# EAGLE schematic shield (EAGLE 7.5.0)
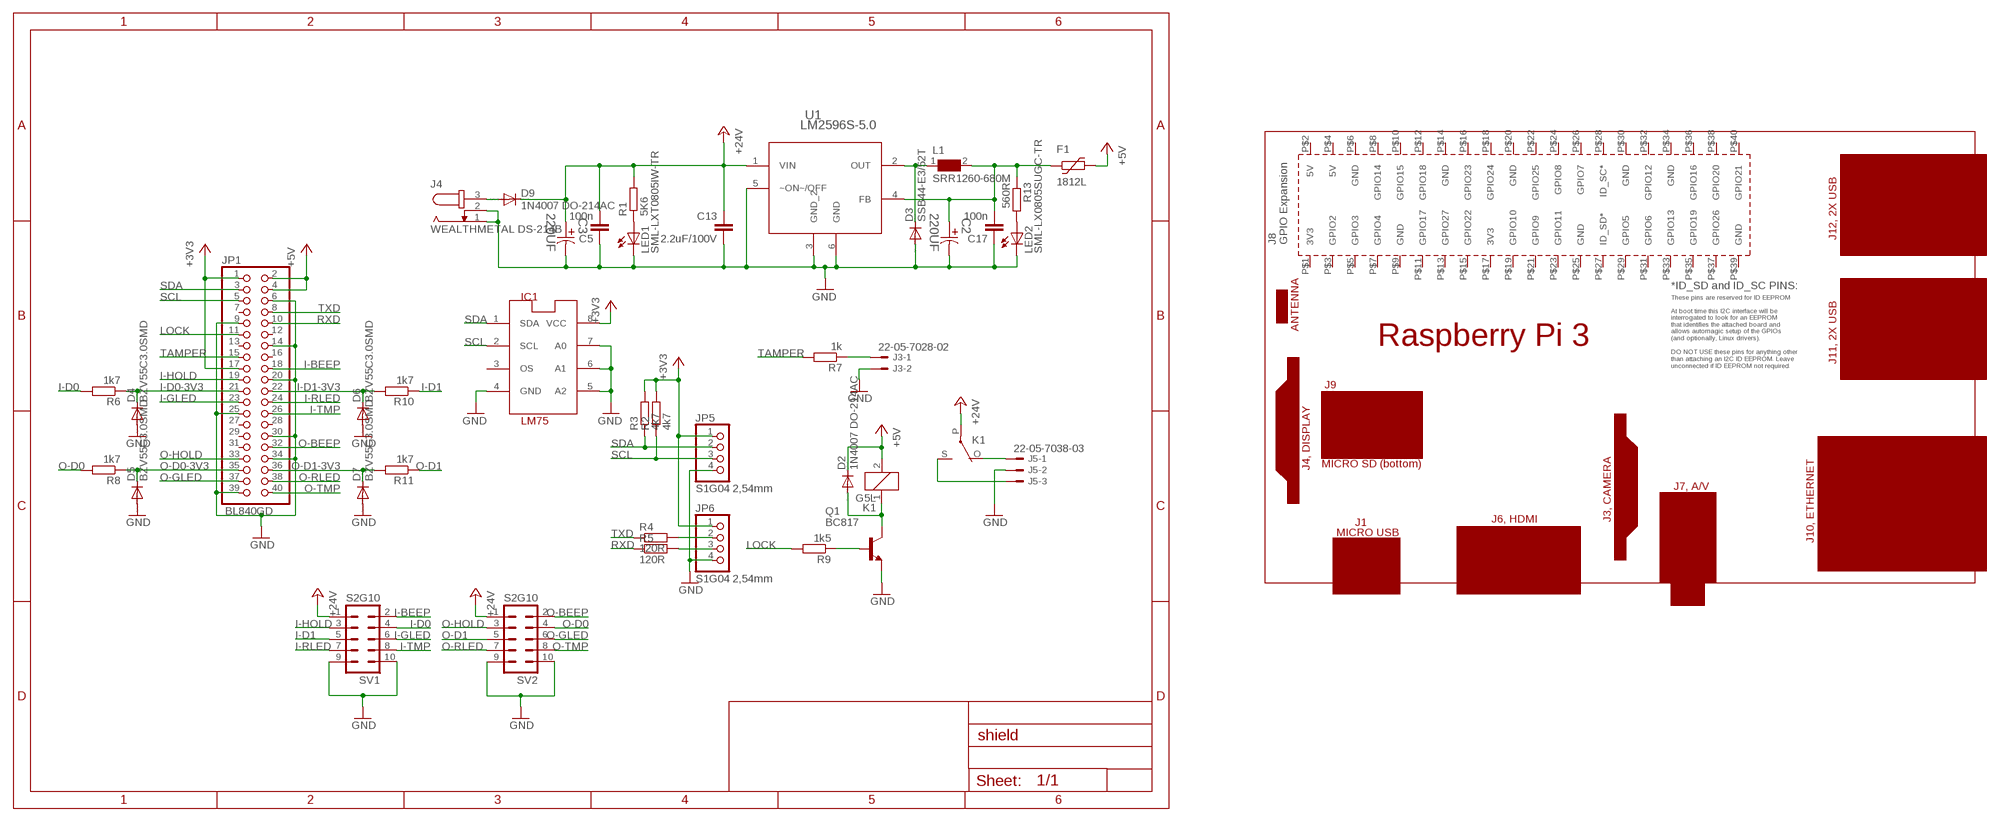
[diagram p0: schematic, sheet 1]

## Parts
C2  220UF  EEE-FP1V221AP-CASE-F  [CAPAE830X1050N]
C3  220UF  EEE-FP1V221AP-CASE-F  [CAPAE830X1050N]
C5  100n  C-EUC0805  [C0805]
C13  2.2uF/100V  C-EUC1206  [C1206]
C17  100n  C-EUC0805  [C0805]
D2  1N4007 DO-214AC  DIODE-DO-214AC  [DO-214AC]
D3  SSB44-E3/52T  DIODE-DO214AA  [DO214AA]
D4  BZV55C3.0SMD  DIODE-MINIMELF  [MINIMELF]
D5  BZV55C3.0SMD  DIODE-MINIMELF  [MINIMELF]
D6  BZV55C3.0SMD  DIODE-MINIMELF  [MINIMELF]
D7  BZV55C3.0SMD  DIODE-MINIMELF  [MINIMELF]
D9  1N4007 DO-214AC  DIODE-DO-214AC  [DO-214AC]
F1  1812L  [1812L]
IC1  LM75  LM75_ICN  [SO8_LM75]
J3  22-05-7028-02  [7395-02]
J4  WEALTHMETAL DS-214B  JACK-PLUG0  [SPC4077]
J5  22-05-7038-03  [7395-03]
JP1  BL840GD  PINHD-2X20  [2X20]
JP5  S1G04 2,54mm  PINHD-1X4  [1X04]
JP6  S1G04 2,54mm  PINHD-1X4  [1X04]
K1  G5L  [G5LE]
L1  SRR1260-680M  WE-PD-7447709680_1260/1245/1280/1210  [WE-PD_1260/1245/1280/1210]
LED1  SML-LXT0805IW-TR  LEDCHIPLED_0805  [CHIPLED_0805]
LED2  SML-LX0805SUGC-TR  LEDCHIPLED_0805  [CHIPLED_0805]
PCB1  RPI3  [RPI3]
Q1  BC817  BC817-16-NPN-SOT23-BEC  [SOT23-BEC]
R1  5K6  R-EU_R0805  [R0805]
R2  4k7  R-EU_R0805  [R0805]
R3  4k7  R-EU_R0805  [R0805]
R4  120R  R-EU_R0805  [R0805]
R5  120R  R-EU_R0805  [R0805]
R6  1k7  R-EU_R0805  [R0805]
R7  1k  R-EU_R0805  [R0805]
R8  1k7  R-EU_R0805  [R0805]
R9  1k5  R-EU_R0805  [R0805]
R10  1k7  R-EU_R0805  [R0805]
R11  1k7  R-EU_R0805  [R0805]
R13  560R  R-EU_R0805  [R0805]
SV1  S2G10  MA05-2  [MA05-2]
SV2  S2G10  MA05-2  [MA05-2]
U1  LM2596S-5.0  [TO170P1435X465-6N]

## Nets
+3V3: IC1.8(VCC) JP1.1 JP1.17 JP5.1 JP6.1 R2.2 R3.2
+5V: D2.C F1.P$2 JP1.2 JP1.4 K1.2
+24V: C3.1 C5.2 C13.1 D9.C K1.P(2:P) R1.2 SV1.1 SV2.1 U1.1(VIN)
GND: C2.2 C3.2 C5.1 C13.2 C17.1 D3.A D4.A D5.A D6.A D7.A IC1.4(GND) IC1.5(A2) IC1.6(A1) IC1.7(A0) J3.2 J4.1 J4.2 J5.2 JP1.6 JP1.9 JP1.14 JP1.20 JP1.25 JP1.30 JP1.34 JP1.39 JP5.4 JP6.4 LED1.C LED2.C Q1.E SV1.9 SV1.10 SV2.9 SV2.10 U1.3(GND_2) U1.5(~ON~/OFF) U1.6(GND)
I-BEEP: JP1.18 SV1.2
I-D0: R6.2 SV1.4
I-D0-3V3: D4.C JP1.21 R6.1
I-D1: R10.1 SV1.5
I-D1-3V3: D6.C JP1.22 R10.2
I-GLED: JP1.23 SV1.6
I-HOLD: JP1.19 SV1.3
I-RLED: JP1.24 SV1.7
I-TMP: JP1.26 SV1.8
LOCK: JP1.11 R9.2
N$1: C2.1 C17.2 F1.P$1 L1.2 R13.1 U1.4(FB)
N$2: J3.1 R7.1
N$3: JP6.2 R4.2
N$4: LED2.A R13.2
N$5: J5.3 K1.S(2:S)
N$6: JP6.3 R5.2
N$7: J5.1 K1.O(2:O)
N$8: D2.A K1.1 Q1.C
N$9: D9.A J4.3
N$10: Q1.B R9.1
N$23: LED1.A R1.1
N$31: D3.C L1.1 U1.2(OUT)
O-BEEP: JP1.32 SV2.2
O-D0: R8.2 SV2.4
O-D0-3V3: D5.C JP1.35 R8.1
O-D1: R11.1 SV2.5
O-D1-3V3: D7.C JP1.36 R11.2
O-GLED: JP1.37 SV2.6
O-HOLD: JP1.33 SV2.3
O-RLED: JP1.38 SV2.7
O-TMP: JP1.40 SV2.8
RXD: JP1.10 R5.1
SCL: IC1.2(SCL) JP1.5 JP5.3 R2.1
SDA: IC1.1(SDA) JP1.3 JP5.2 R3.1
TAMPER: JP1.15 R7.2
TXD: JP1.8 R4.1
Unconnected: IC1.3(OS) JP1.7 JP1.12 JP1.13 JP1.16 JP1.27 JP1.28 JP1.29 JP1.31 PCB1.P$1(3V3) PCB1.P$2(5V) PCB1.P$3(GPIO2) PCB1.P$4(5V) PCB1.P$5(GPIO3) PCB1.P$6(GND) PCB1.P$7(GPIO4) PCB1.P$8(GPIO14) PCB1.P$9(GND) PCB1.P$10(GPIO15) PCB1.P$11(GPIO17) PCB1.P$12(GPIO18) PCB1.P$13(GPIO27) PCB1.P$14(GND) PCB1.P$15(GPIO22) PCB1.P$16(GPIO23) PCB1.P$17(3V3) PCB1.P$18(GPIO24) PCB1.P$19(GPIO10) PCB1.P$20(GND) PCB1.P$21(GPIO9) PCB1.P$22(GPIO25) PCB1.P$23(GPIO11) PCB1.P$24(GPIO8) PCB1.P$25(GND) PCB1.P$26(GPIO7) PCB1.P$27(ID_SD*) PCB1.P$28(ID_SC*) PCB1.P$29(GPIO5) PCB1.P$30(GND) PCB1.P$31(GPIO6) PCB1.P$32(GPIO12) PCB1.P$33(GPIO13) PCB1.P$34(GND) PCB1.P$35(GPIO19) PCB1.P$36(GPIO16) PCB1.P$37(GPIO26) PCB1.P$38(GPIO20) PCB1.P$39(GND) PCB1.P$40(GPIO21)

## Library data of the parts
C2 C3 = Panasonic-EEEFK_EEEFP:EEE-: Aluminum Electrolytic Capacitors,Surface Mount Type; MPN: EEE-FP1V221AP; OC_FARNELL: 1539514; OC_NEWARK: 94M7043; PACKAGE: CASE-F; SUPPLIER: PANASONIC; TOLERANCE: ±20 %; VOLTAGERATING: 35V
C5 C13 C17 = rcl:C-EU: CAPACITOR, European symbol
D2-D7 D9 = diode:DIODE-: DIODE
F1 = ptc-littlefuse:1812L
IC1 = lm75:LM75_IC: Temperatursensor
J3 = con-molex:22-?-02: CONNECTOR wire to board 2.54 mm (.1 inch) pitch header; OC_FARNELL: 9731601; OC_NEWARK: unknown
J4 = con-jack:JACK-PLUG: DC POWER JACK Power Jack, DC, Right Angle, Through Hole, Rated 5A at 16VDC, PC Terminals Distributor: Farnell (www.Farnell.de) Drawing: 84N1161.pdf / 84N1162.pdf Manufacturer: SPC Technology (www.spctechnology.com) Type: SPC4077 / SPC 4078; OC_FARNELL: unknown; OC_NEWARK: unknown
J5 = con-molex:22-?-03: CONNECTOR wire to board 2.54 mm (.1 inch) pitch header; OC_FARNELL: unknown; OC_NEWARK: unknown
JP1 = pinhead:PINHD-2X20: PIN HEADER
JP5 JP6 = pinhead:PINHD-1X4: PIN HEADER
K1 = relay:G5L: RELAY 1 x switch, 10 A/120 V AC, 8 A/30 V ADC, Omron; OC_FARNELL: unknown; OC_NEWARK: unknown
L1 = WE-PD:WE-PD: SMD-Shielded Power Inductors WE-PD - Magnetically shielded version which results in a low leakage field - High storage capacity - Low self-losses - Highest possible current loading for SMD-Inducors -- Switching regulators with low operating voltages (computer, laptop, mobile phones, pagers) -- Integrated DC/DC-converter -- Is recommended for the application with switching regulators from National Semiconductor, Linear Technology, Texas Instruments and Fairchild Semiconductor, ect. -- Graphic cards -- Plastic base: Because of the one piece construction these are more suitable for high vibration or shock applications; MPN: 7447709680; OC_FARNELL: 1635947; OC_NEWARK: 08P2779; PACKAGE: 1210; SUPPLIER: Wuerth Elektronik
LED1 LED2 = led:LED: LED OSRAM: - CHIPLED LG R971, LG N971, LY N971, LG Q971, LY Q971, LO R971, LY R971 LH N974, LH R974 LS Q976, LO Q976, LY Q976 LO Q996 - Hyper CHIPLED LW Q18S LB Q993, LB Q99A, LB R99A - SideLED LS A670, LO A670, LY A670, LG A670, LP A670 LB A673, LV A673, LT A673, LW A673 LH A674 LY A675 LS A676, LA A676, LO A676, LY A676, LW A676 LS A679, LY A679, LG A679 - Hyper Micro SIDELED® LS Y876, LA Y876, LO Y876, LY Y876 LT Y87S - SmartLED LW L88C, LW L88S LB L89C, LB L89S, LG L890 LS L89K, LO L89K, LY L89K LS L896, LA L896, LO L896, LY L896 - TOPLED LS T670, LO T670, LY T670, LG T670, LP T670 LSG T670, LSP T670, LSY T670, LOP T670, LYG T670 LG T671, LOG T671, LSG T671 LB T673, LV T673, LT T673, LW T673 LH T674 LS T676, LA T676, LO T676, LY T676, LB T676, LH T676, LSB T676, LW T676 LB T67C, LV T67C, LT T67C, LS T67K, LO T67K, LY T67K, LW E67C LS E67B, LA E67B, LO E67B, LY E67B, LB E67C, LV E67C, LT E67C LW T67C LS T679, LY T679, LG T679 LS T770, LO T770, LY T770, LG T770, LP T770 LB T773, LV T773, LT T773, LW T773 LH T774 LS E675, LA E675, LY E675, LS T675 LS T776, LA T776, LO T776, LY T776, LB T776 LHGB T686 LT T68C, LB T68C - Hyper Mini TOPLED® LB M676 - Mini TOPLED Santana® LG M470 LS M47K, LO M47K, LY M47K Source: http://www.osram.convergy.de LUXEON: - LUMILED® LXK2-PW12-R00, LXK2-PW12-S00, LXK2-PW14-U00, LXK2-PW14-V00 LXK2-PM12-R00, LXK2-PM12-S00, LXK2-PM14-U00 LXK2-PE12-Q00, LXK2-PE12-R00, LXK2-PE12-S00, LXK2-PE14-T00, LXK2-PE14-U00 LXK2-PB12-K00, LXK2-PB12-L00, LXK2-PB12-M00, LXK2-PB14-N00, LXK2-PB14-P00, LXK2-PB14-Q00 LXK2-PR12-L00, LXK2-PR12-M00, LXK2-PR14-Q00, LXK2-PR14-R00 LXK2-PD12-Q00, LXK2-PD12-R00, LXK2-PD12-S00 LXK2-PH12-R00, LXK2-PH12-S00 LXK2-PL12-P00, LXK2-PL12-Q00, LXK2-PL12-R00 Source: www.luxeon.com KINGBRIGHT: KA-3528ASYC Source: www.kingbright.com
PCB1 = e14_Rpi3_RevA:RPI3: Device for Raspberry Pi 3 board created by Dave Young for www.element14.com More information and support community is available at https://www.element14.com/community/community/raspberry-pi
Q1 = transistor:*-NPN-: NPN Transistror BF959 corrected 2008.03.06
R1-R11 R13 = rcl:R-EU_: RESISTOR, European symbol
SV1 SV2 = con-lstb:MA05-2: PIN HEADER; OC_FARNELL: unknown; OC_NEWARK: unknown
U1 = mylib:LM2596S-5.0: Step-Down Voltage Regulator; MPN: LM2596S-50; OC_FARNELL: 1214546; OC_NEWARK: 41K3844; PACKAGE: TO-263-5; SUPPLIER: National